# EAGLE design LM-317_power_supply (EAGLE 6.3)
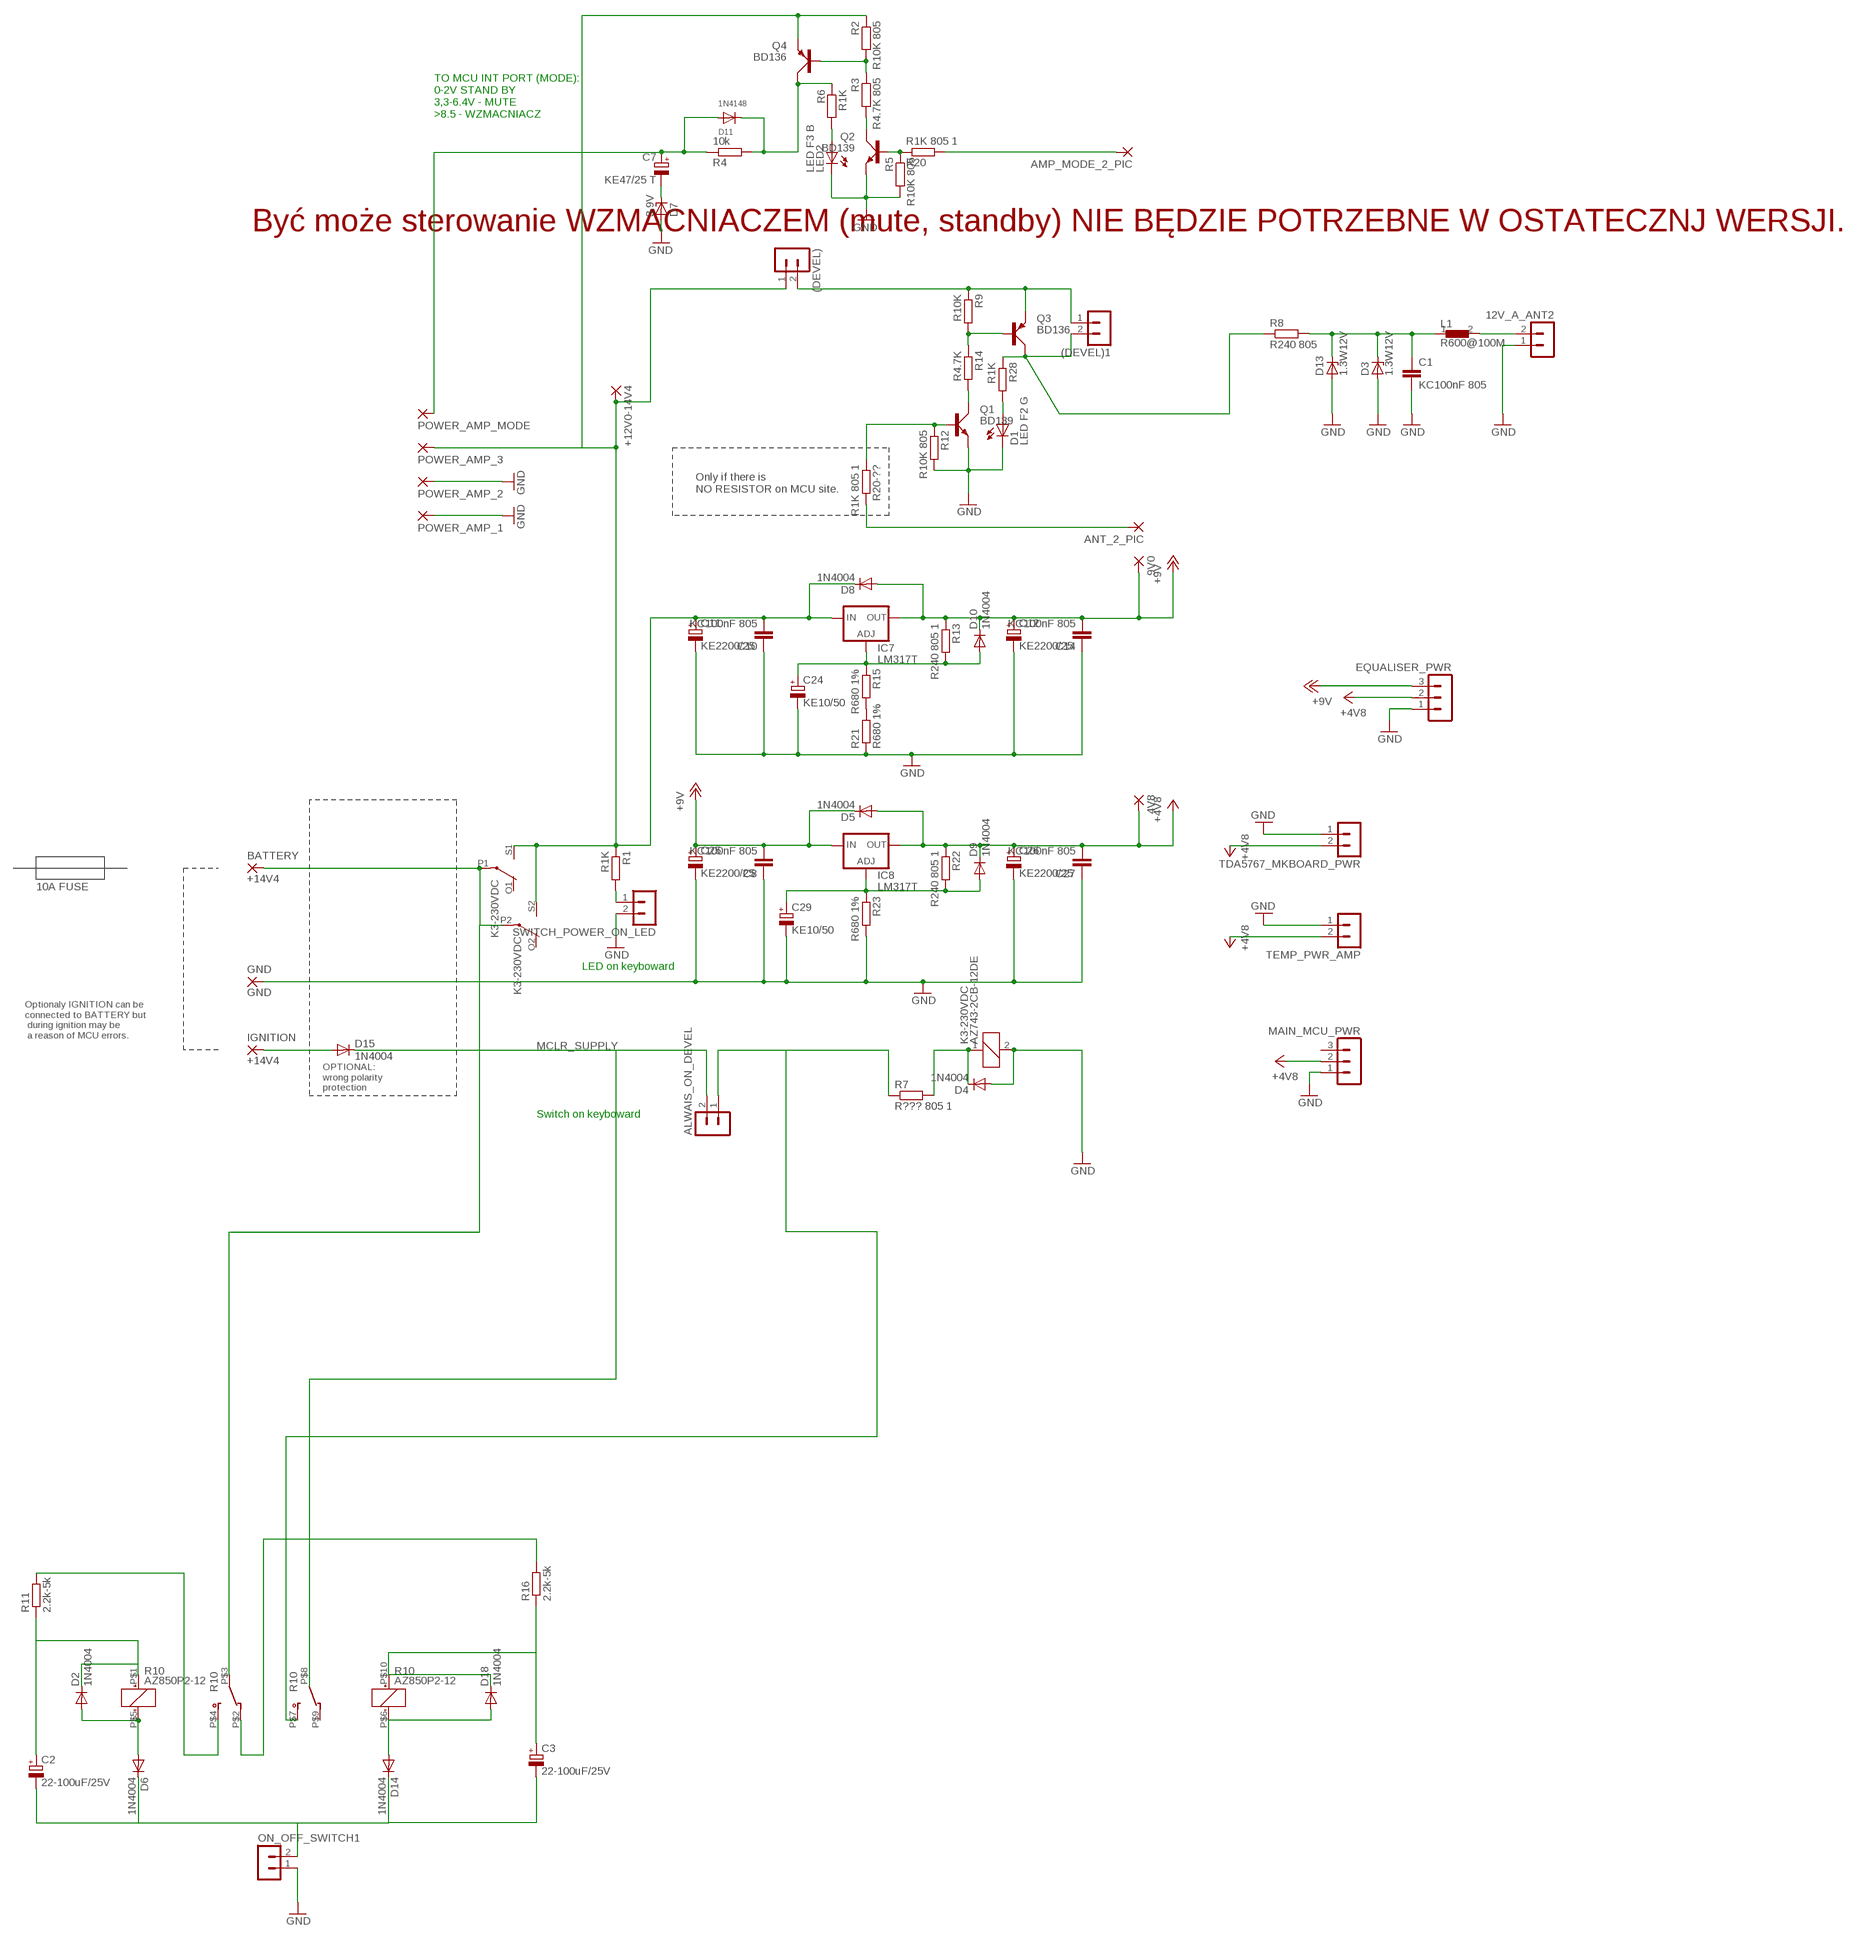
[diagram p0: schematic, sheet 1]

## Parts
4V8  3,17/1,3  [3,17/1,3]
9V0  3,17/1,3  [3,17/1,3]
12V_A_ANT2  MA02-1  [MA02-1]
(DEVEL)  MA02-1  [MA02-1]
(DEVEL)1  MA02-1  [MA02-1]
+12V0-14V4  3,17/1,3  [3,17/1,3]
ALWAIS_ON_DEVEL  MA02-1  [MA02-1]
AMP_MODE_2_PIC  1,6/0,8  [1,6/0,8]
ANT_2_PIC  1,6/0,8  [1,6/0,8]
BATTERY  +14V4  3,81/1,3  [3,81/1,3]
C1  KC100nF 805  C-EUC0805  [C0805]
C2  22-100uF/25V  CPOL-EUE2,5-6E  [E2,5-6E]
C3  22-100uF/25V  CPOL-EUE2,5-6E  [E2,5-6E]
C7  KE47/25 T  CPOL-EUB45181A  [B45181A]
C8  KC100nF 805  C-EUC0805  [C0805]
C10  KC100nF 805  C-EUC0805  [C0805]
C11  KE2200/25  CPOL-EUE3.5-8  [E3,5-8]
C12  KE2200/25  CPOL-EUE3.5-8  [E3,5-8]
C14  KC100nF 805  C-EUC0805  [C0805]
C24  KE10/50  CPOL-EUTT2D4  [TT2D4]
C25  KE2200/25  CPOL-EUE3.5-8  [E3,5-8]
C26  KE2200/25  CPOL-EUE3.5-8  [E3,5-8]
C27  KC100nF 805  C-EUC0805  [C0805]
C29  KE10/50  CPOL-EUTT2D4  [TT2D4]
D1  LED F2 G  SFH482  [SFH482]
D2  1N4004  1N4004DO41-7.6  [DO41-7.6]
D3  1.3W12V  ZENER-DIODEZD-2.5  [ZDIO-2.5]
D4  1N4004  1N4004DO41-7.6  [DO41-7.6]
D5  1N4004  1N4004DO41-7.6  [DO41-7.6]
D6  1N4004  1N4004DO41-7.6  [DO41-7.6]
D7  3.9V  ZENER-DIODEZD-5  [ZDIO-5]
D8  1N4004  1N4004DO41-7.6  [DO41-7.6]
D9  1N4004  1N4004DO41-7.6  [DO41-7.6]
D10  1N4004  1N4004DO41-7.6  [DO41-7.6]
D11  1N4148  DIODEDO-1N4148  [DO-1N4148]
D13  1.3W12V  ZENER-DIODEZD-2.5  [ZDIO-2.5]
D14  1N4004  1N4004DO41-7.6  [DO41-7.6]
D15  1N4004  1N4004DO41-7.6  [DO41-7.6]
D18  1N4004  1N4004DO41-7.6  [DO41-7.6]
EQUALISER_PWR  MA03-1  [MA03-1]
GND  GND  3,81/1,3  [3,81/1,3]
IC7  LM317T  LM317TS  [317TS]
IC8  LM317T  LM317TS  [317TS]
IGNITION  +14V4  3,81/1,3  [3,81/1,3]
K3-230VDC  AZ743-2CB-12DE  G2R2  [G2R2]
L1  R600@100M  FERRITR0805  [R0805]
LED2  LED F3 B  LED3MM  [LED3MM]
MAIN_MCU_PWR  MA03-1  [MA03-1]
ON_OFF_SWITCH1  MA02-1  [MA02-1]
POWER_AMP_1  3,17/1,3  [3,17/1,3]
POWER_AMP_2  3,17/1,3  [3,17/1,3]
POWER_AMP_3  3,17/1,3  [3,17/1,3]
POWER_AMP_MODE  3,17/1,3  [3,17/1,3]
Q1  BD139  [TO126AV]
Q2  BD139  [TO126AV]
Q3  BD136  BD140  [TO126AV]
Q4  BD136  BD140  [TO126AV]
R1  R1K  R-EU_0204/7  [0204/7]
R2  R10K 805  R-EU_R0805  [R0805]
R3  R4.7K 805  R-EU_R0805  [R0805]
R4  10k  R-EU_0204/5  [0204/5]
R5  R10K 805  R-EU_R0805  [R0805]
R6  R1K  R-EU_0204/2V  [0204V]
R7  R??? 805 1  R-EU_M0805  [M0805]
R8  R240 805  R-EU_M0805  [M0805]
R9  R10K  R-EU_0204/5  [0204/5]
R10  AZ850P2-12  [AZ850-2C]
R11  2.2k-5k  R-EU_0204/5  [0204/5]
R12  R10K 805  R-EU_R0805  [R0805]
R13  R240 805 1  R-EU_M0805  [M0805]
R14  R4.7K  R-EU_0204/5  [0204/5]
R15  R680 1%  R-EU_0204/5  [0204/5]
R16  2.2k-5k  R-EU_0204/5  [0204/5]
R20  R1K 805 1  R-EU_R0805  [R0805]
R20-??  R1K 805 1  R-EU_0204/2V  [0204V]
R21  R680 1%  R-EU_0204/5  [0204/5]
R22  R240 805 1  R-EU_M0805  [M0805]
R23  R680 1%  R-EU_0204/5  [0204/5]
R28  R1K  R-EU_0204/7  [0204/7]
SWITCH_POWER_ON_LED  MA02-1  [MA02-1]
TDA5767_MKBOARD_PWR  MA02-1  [MA02-1]
TEMP_PWR_AMP  MA02-1  [MA02-1]

## Nets
+4V8: 4V8.1(P) C26.+ C27.2 D5.A D9.C EQUALISER_PWR.2 IC8.2(OUT) MAIN_MCU_PWR.2 R22.1 TDA5767_MKBOARD_PWR.2 TEMP_PWR_AMP.2
+9V: 9V0.1(P) C8.2 C12.+ C14.2 C25.+ D5.C D8.A D10.C EQUALISER_PWR.3 IC7.2(OUT) IC8.3(IN) R13.1
+14.4V: (DEVEL).1 +12V0-14V4.1(P) C10.2 C11.+ D8.C IC7.3(IN) K3-230VDC.S1(2:S) K3-230VDC.S2(3:S) POWER_AMP_3.1(P) Q4.E R1.1 R2.1
AMP_MODE: AMP_MODE_2_PIC.1(P) R20.2
GND: 12V_A_ANT2.1 C1.2 C8.1 C10.1 C11.- C12.- C14.1 C24.- C25.- C26.- C27.1 C29.- D1.K(C) D3.A D4.A D7.A D13.A EQUALISER_PWR.1 GND.1(P) K3-230VDC.2 LED2.K(C) MAIN_MCU_PWR.1 ON_OFF_SWITCH1.1 POWER_AMP_1.1(P) POWER_AMP_2.1(P) Q1.E Q2.E R5.2 R12.2 R21.1 R23.2 SWITCH_POWER_ON_LED.2 TDA5767_MKBOARD_PWR.1 TEMP_PWR_AMP.1
MCLR_SUPPLY: ALWAIS_ON_DEVEL.2 D15.C
N$1: ANT_2_PIC.1(P) R20-??.2
N$2: C24.+ D10.A IC7.1(ADJ) R13.2 R15.1
N$3: R15.2 R21.2
N$4: (DEVEL)1.1 (DEVEL).2 Q3.E R9.1
N$6: BATTERY.1(P) K3-230VDC.P1(2:P) K3-230VDC.P2(3:P) R10.P$3
N$7: D4.C K3-230VDC.1 R7.2
N$8: ALWAIS_ON_DEVEL.1 R7.1 R10.P$7
N$9: R1.2 SWITCH_POWER_ON_LED.1
N$10: D11.C Q4.C R4.2 R6.1
N$11: C1.1 D3.C D13.C L1.1 R8.2
N$12: 12V_A_ANT2.2 L1.2
N$13: D15.A IGNITION.1(P)
N$14: C2.+ D2.C R10.P$1(S$1:+) R11.1
N$15: D2.A D6.A R10.P$5(S$1:-)
N$16: C3.+ D18.C R10.P$10(R$2:+) R16.1
N$18: Q1.B R12.1 R20-??.1
N$19: Q1.C R14.2
N$20: C2.- C3.- D6.C D14.C ON_OFF_SWITCH1.2
N$21: C7.- D7.C
N$23: C7.+ D11.A POWER_AMP_MODE.1(P) R4.1
N$24: D14.A D18.A R10.P$6(R$2:-)
N$25: Q3.B R9.2 R14.1
N$26: (DEVEL)1.2 Q3.C R8.1 R28.1
N$27: C29.+ D9.A IC8.1(ADJ) R22.2 R23.1
N$30: R10.P$4 R11.2
N$31: R10.P$2 R16.2
N$40: D1.A R28.2
N$47: Q2.B R5.1 R20.1
N$48: Q2.C R3.2
N$49: Q4.B R2.2 R3.1
N$52: LED2.A R6.2
Unconnected: K3-230VDC.O1(2:O) K3-230VDC.O2(3:O) MAIN_MCU_PWR.3 R10.P$8 R10.P$9

## Notes on the sheet
- TO MCU INT PORT (MODE): 
  0-2V STAND BY
  3,3-6.4V - MUTE
  >8.5 - WZMACNIACZ
- Być może sterowanie WZMACNIACZEM (mute, standby) NIE BĘDZIE POTRZEBNE W OSTATECZNJ WERSJI.
- Only if there is
  NO RESISTOR on MCU site.
- 10A FUSE
- LED on keyboward
- Optionaly IGNITION can be
  connected to BATTERY but
   during ignition may be
   a reason of MCU errors.
- OPTIONAL:
  wrong polarity
  protection
- Switch on keyboward

## Library data of the parts
4V8 9V0 +12V0-14V4 POWER_AMP_1-POWER_AMP_3 POWER_AMP_MODE = wirepad:3,17/1,3: THROUGH-HOLE PAD
12V_A_ANT2 (DEVEL) (DEVEL)1 ALWAIS_ON_DEVEL ON_OFF_SWITCH1 SWITCH_POWER_ON_LED TDA5767_MKBOARD_PWR TEMP_PWR_AMP = con-lstb_SileliS:MA02-1: PIN HEADER
AMP_MODE_2_PIC ANT_2_PIC = wirepad:1,6/0,8: THROUGH-HOLE PAD
BATTERY GND IGNITION = wirepad:3,81/1,3: THROUGH-HOLE PAD
C1 C8 C10 C14 C27 = rcl:C-EU: CAPACITOR, European symbol
C2 C3 = resistor:CPOL-EU: POLARIZED CAPACITOR, European symbol
C7 C11 C12 C24-C26 C29 = rcl:CPOL-EU: POLARIZED CAPACITOR, European symbol
D1 = led:SFH482: IR LED infrared emitting diode, Infineon
D2 D4-D6 D8-D10 D14 D15 D18 = diode_SileliS:1N4004: DIODE general purpose rectifier, 1 A
D3 D7 D13 = diode:ZENER-DIODE: Z-Diode
D11 = adafruit:DIODE: Diode SMADIODE - SMA Surface Mount Package 20V 1A Schottky Diode Digikey: 641-1014-6-ND DO-1N4148 - Through Hole Small Current Diode SOD-123 20V 1 A (.5mV Vf) Schottky Diode - Digikey: MBRX120TPMSCT-ND SOD-323 10V 570mA (.38mV Vf, 3ns) Schottky Diode - Digikey: ZLLS410CT-ND SOD-523 30V 30mA Schottky Diode (RB751S-40TE61) - Digikey: RB751S-40TE61CT-ND SOT23-R/W - SOT23 Package (R = Solder Paste/Reflow Ovens, W = Hand-Soldering) BAT54Film 40V 300mA - Digikey: 497-7162-1-ND
EQUALISER_PWR MAIN_MCU_PWR = con-lstb_SileliS:MA03-1: PIN HEADER; OC_FARNELL: unknown; OC_NEWARK: unknown
IC7 IC8 = v-reg:LM317TS: VOLTAGE REGULATOR
K3-230VDC = relay:G2R2: RELAY 2 x switch, Omron; MF: OMRON COMPONENTS USA; MPN: G2R-2-DC6; OC_FARNELL: unknown; OC_NEWARK: 89C5317
L1 = ferrit_bear:FERRIT
LED2 = led:LED: LED OSRAM: - CHIPLED LG R971, LG N971, LY N971, LG Q971, LY Q971, LO R971, LY R971 LH N974, LH R974 LS Q976, LO Q976, LY Q976 LO Q996 - Hyper CHIPLED LW Q18S LB Q993, LB Q99A, LB R99A - SideLED LS A670, LO A670, LY A670, LG A670, LP A670 LB A673, LV A673, LT A673, LW A673 LH A674 LY A675 LS A676, LA A676, LO A676, LY A676, LW A676 LS A679, LY A679, LG A679 - Hyper Micro SIDELED® LS Y876, LA Y876, LO Y876, LY Y876 LT Y87S - SmartLED LW L88C, LW L88S LB L89C, LB L89S, LG L890 LS L89K, LO L89K, LY L89K LS L896, LA L896, LO L896, LY L896 - TOPLED LS T670, LO T670, LY T670, LG T670, LP T670 LSG T670, LSP T670, LSY T670, LOP T670, LYG T670 LG T671, LOG T671, LSG T671 LB T673, LV T673, LT T673, LW T673 LH T674 LS T676, LA T676, LO T676, LY T676, LB T676, LH T676, LSB T676, LW T676 LB T67C, LV T67C, LT T67C, LS T67K, LO T67K, LY T67K, LW E67C LS E67B, LA E67B, LO E67B, LY E67B, LB E67C, LV E67C, LT E67C LW T67C LS T679, LY T679, LG T679 LS T770, LO T770, LY T770, LG T770, LP T770 LB T773, LV T773, LT T773, LW T773 LH T774 LS E675, LA E675, LY E675, LS T675 LS T776, LA T776, LO T776, LY T776, LB T776 LHGB T686 LT T68C, LB T68C - Hyper Mini TOPLED® LB M676 - Mini TOPLED Santana® LG M470 LS M47K, LO M47K, LY M47K Source: http://www.osram.convergy.de LUXEON: - LUMILED® LXK2-PW12-R00, LXK2-PW12-S00, LXK2-PW14-U00, LXK2-PW14-V00 LXK2-PM12-R00, LXK2-PM12-S00, LXK2-PM14-U00 LXK2-PE12-Q00, LXK2-PE12-R00, LXK2-PE12-S00, LXK2-PE14-T00, LXK2-PE14-U00 LXK2-PB12-K00, LXK2-PB12-L00, LXK2-PB12-M00, LXK2-PB14-N00, LXK2-PB14-P00, LXK2-PB14-Q00 LXK2-PR12-L00, LXK2-PR12-M00, LXK2-PR14-Q00, LXK2-PR14-R00 LXK2-PD12-Q00, LXK2-PD12-R00, LXK2-PD12-S00 LXK2-PH12-R00, LXK2-PH12-S00 LXK2-PL12-P00, LXK2-PL12-Q00, LXK2-PL12-R00 Source: www.luxeon.com KINGBRIGHT: KA-3528ASYC Source: www.kingbright.com
Q1 Q2 = transistor-power:BD139: NPN TRANSISTOR
Q3 Q4 = transistor-power:BD140: PNP TRANSISTOR
R1-R9 R12-R15 R20 R20-?? R21-R23 R28 = rcl:R-EU_: RESISTOR, European symbol
R10 = relay_silelis:AZ850P2-12
R11 R16 = resistor:R-EU_: RESISTOR, European symbol

## Board
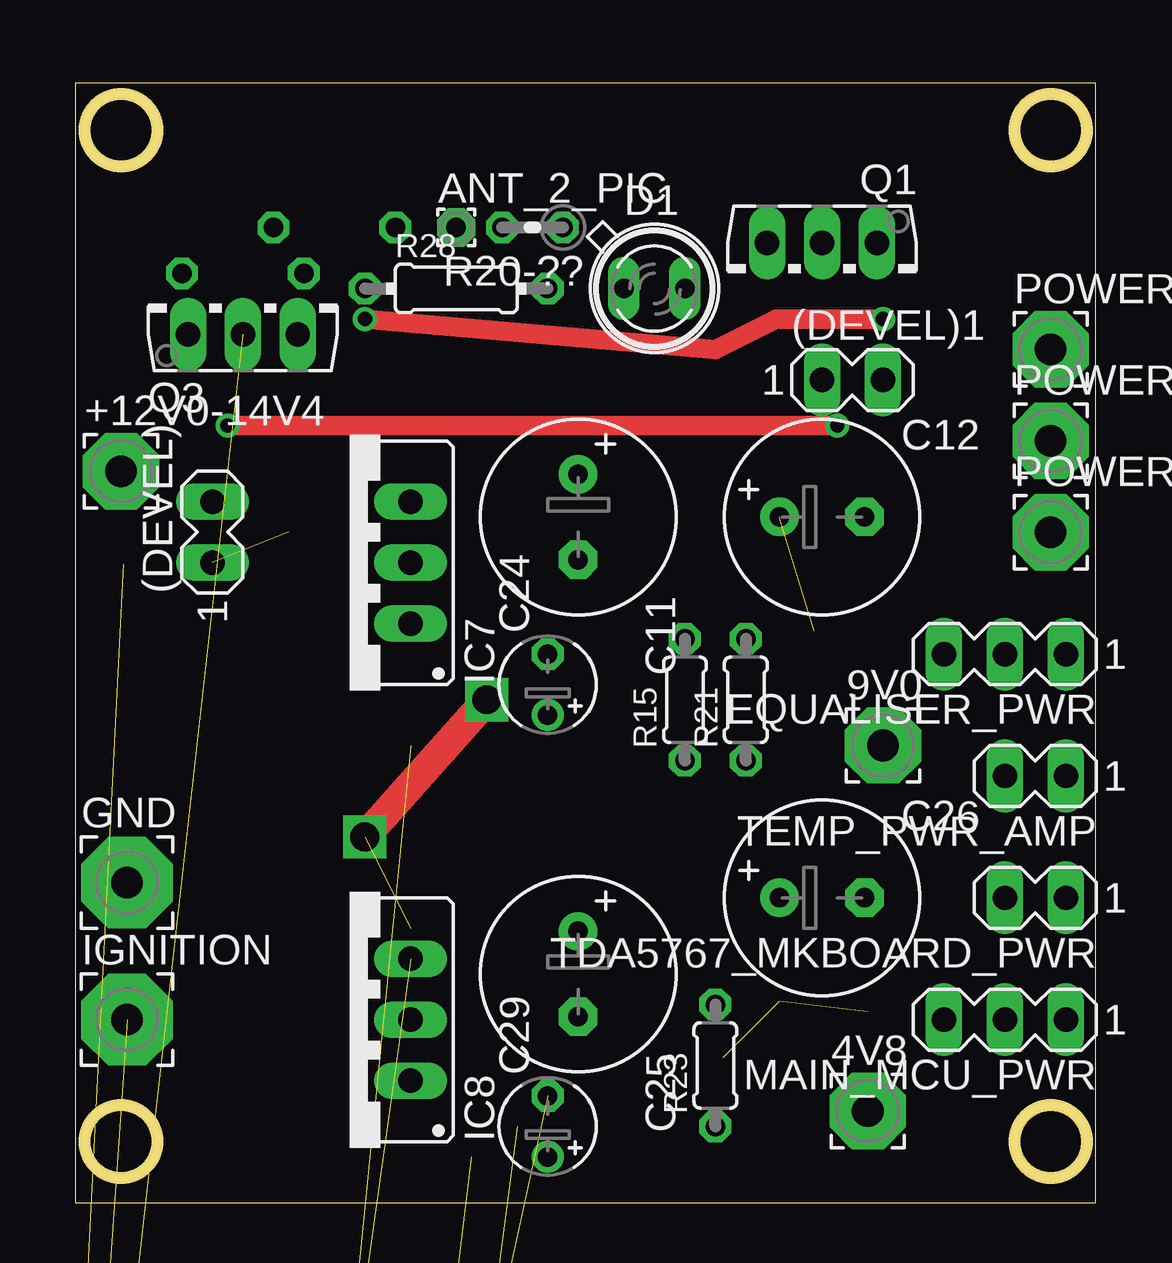
[diagram p1: board, top side]
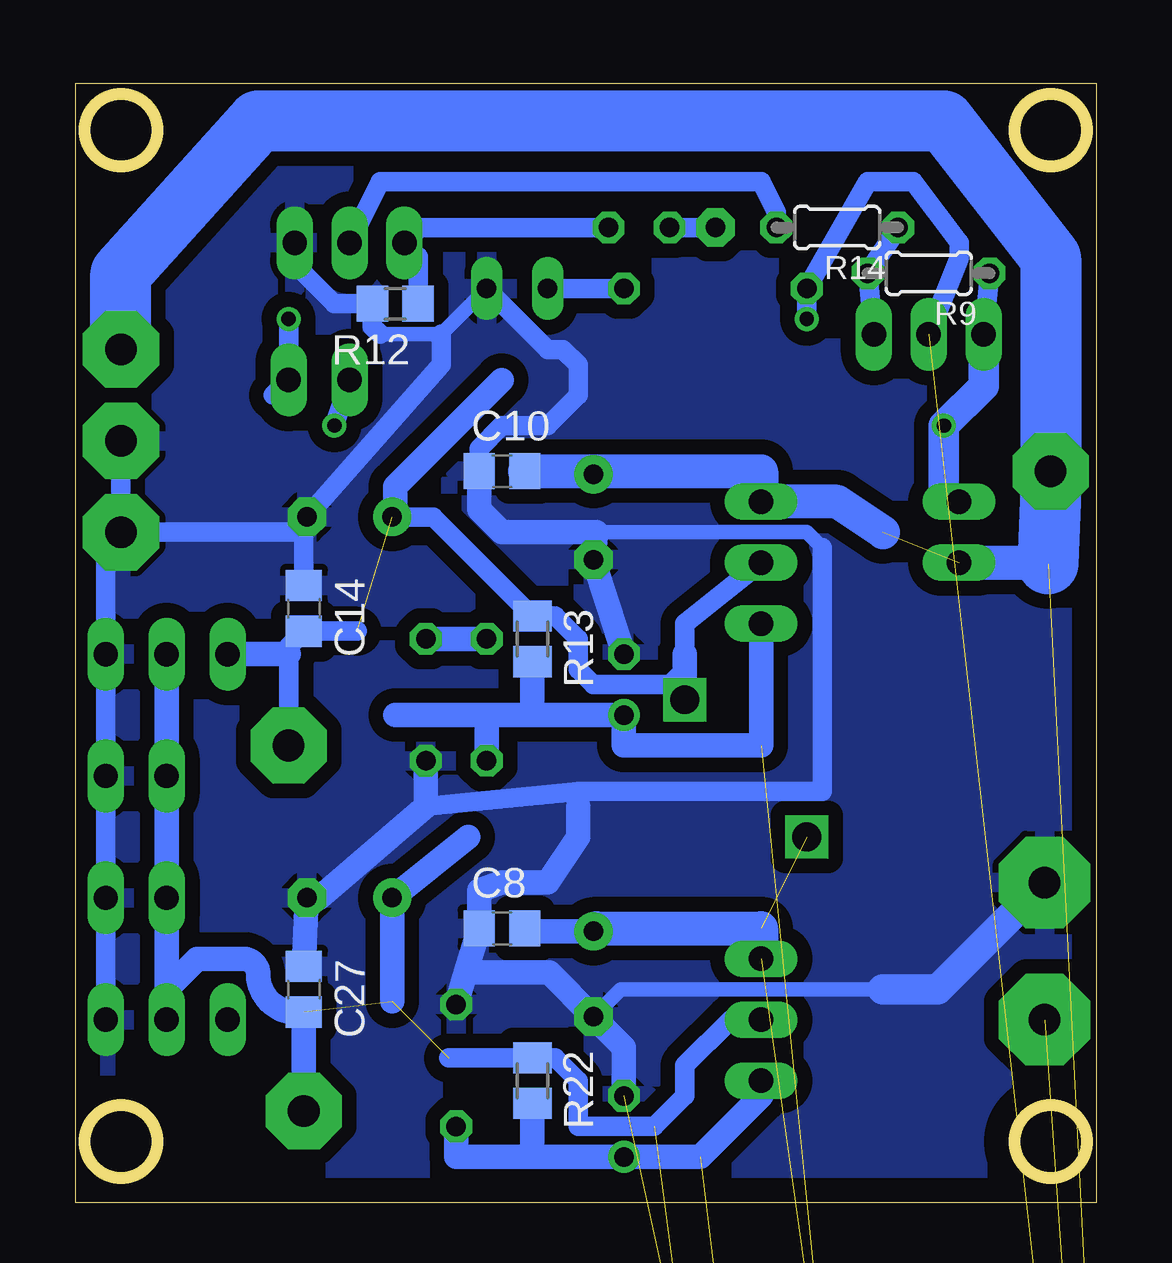
[diagram p2: board, bottom side, seen from below]

Size 42.52 x 46.66 mm. Coordinates in mm from the lower left corner, seen from the top.
Outline: 0,0 42.52,0 42.52,46.66 0,46.66 0,0
Outline: circle at 1.9,44.7 radius 1.5
Outline: circle at 40.64,2.54 radius 1.5
Outline: circle at 40.64,44.7 radius 1.5
Outline: circle at 1.9,2.54 radius 1.5
Copper layers (1*16): Top 0.035mm / dielectric 1.5mm / Bottom 0.035mm
Design rules "default": minimum track width 10mil, minimum drill 24mil, track to track 8mil, track to pad 8mil, pad to pad 8mil, via to via 8mil, smd to smd 8mil, copper to edge 40mil, drill to drill 8mil, minimum pad ring 10mil, minimum via ring 8mil, stop-mask expansion 4mil, vias tented up to drill 0mil, thermal gap 10mil

### Footprints (pad centres in the part's own frame; a part is rotated, then mirrored left to right if it is on the bottom)
3,17/1,3 = drill 1.321 pad 3.175 octagon: 1 0,0
MA02-1 = drill 1.016 long: 1 -2.54,0; 2 0,0
1,6/0,8 = drill 0.813 pad 1.6 octagon: 1 0,0
3,81/1,3 = drill 1.321 pad 3.81 octagon: 1 0,0
C0805 = smd 1.3 x 1.5: 1 -0.95,0; 2 0.95,0
E2,5-6E = drill 0.813 pad 1.575: + -1.27,0 | drill 0.813 pad 1.575 octagon: - 1.27,0
B45181A = drill 0.813 pad 1.6: + -1.27,0 | drill 0.813 pad 1.6 octagon: - 1.27,0
E3,5-8 = drill 0.813 pad 1.6: + -1.778,0 | drill 0.813 pad 1.6 octagon: - 1.778,0
TT2D4 = drill 0.813: + -1.27,0 | drill 0.813 octagon: - 1.27,0
SFH482 = drill 0.813 long: A -1.27,0; K 1.27,0
DO41-7.6 = drill 1.1 pad 1.7: A 3.81,0; C -3.81,0
ZDIO-2.5 = drill 0.813 octagon: A 1.27,0; C -1.27,0
ZDIO-5 = drill 0.813 octagon: A 2.54,0; C -2.54,0
DO-1N4148 = drill 0.9: A -3.81,0; C 3.81,0
MA03-1 = drill 1.016 long: 1 -2.54,0; 2 0,0; 3 2.54,0
317TS = drill 1.016 long: 1 -2.54,-2.54; 2 0,-2.54; 3 2.54,-2.54
G2R2 = drill 1.321 long: 1 -2.54,-3.683; 2 -2.54,3.81; O1 12.471,3.81; O2 12.471,-3.683; P1 17.45,3.81; P2 17.45,-3.683; S1 22.454,3.81; S2 22.454,-3.683
R0805 = smd 1.3 x 1.5: 1 -0.95,0; 2 0.95,0
LED3MM = drill 0.813 octagon: A -1.27,0; K 1.27,0
TO126AV = drill 1.016 long: B 2.286,-1.27; C 0,-1.27; E -2.286,-1.27
0204/7 = drill 0.813 octagon: 1 -3.81,0; 2 3.81,0
0204/5 = drill 0.813 octagon: 1 -2.54,0; 2 2.54,0
0204V = drill 0.813 octagon: 1 -1.27,0; 2 1.27,0
M0805 = smd 1.3 x 1.6: 1 -0.95,0; 2 0.95,0
AZ850-2C = drill 0.6 octagon: P$1 -5.08,3.81; P$2 -2.54,3.81; P$3 0,3.81; P$4 2.54,3.81; P$5 5.08,3.81; P$6 5.08,-3.81; P$7 2.54,-3.81; P$8 0,-3.81; P$9 -2.54,-3.81; P$10 -5.08,-3.81

### Placement (x,y rotation side)
4V8  33.02,3.81 0 top
9V0  33.66,19.05 0 top
12V_A_ANT2  -19.69,-143.51 0 top  (outside the outline)
(DEVEL)  5.71,29.21 90 top
(DEVEL)1  33.66,34.29 0 top
+12V0-14V4  1.9,30.48 0 top
ALWAIS_ON_DEVEL  -19.69,-7.62 0 top  (outside the outline)
AMP_MODE_2_PIC  -10.8,-69.85 0 top  (outside the outline)
ANT_2_PIC  15.88,40.64 0 top
BATTERY  -16.89,19.05 0 top  (outside the outline)
C1  -22.23,-124.46 0 top  (outside the outline)
C2  -22.23,-175.26 0 top  (outside the outline)
C3  -22.23,-181.61 0 top  (outside the outline)
C7  -9.53,-39.37 0 top  (outside the outline)
C8  24.77,11.43 0 bottom
C10  24.77,30.48 0 bottom
C11  20.95,28.57 270 top
C12  31.11,28.57 0 top
C14  33.02,24.77 270 bottom
C24  19.68,21.59 90 top
C25  20.95,9.53 270 top
C26  31.11,12.7 0 top
C27  33.02,8.89 270 bottom
C29  19.68,3.18 90 top
D1  24.13,38.1 0 top
D2  -19.69,-219.71 0 top  (outside the outline)
D3  -22.23,-137.16 0 top  (outside the outline)
D4  -19.69,-288.29 0 top  (outside the outline)
D5  -19.69,-257.81 0 top  (outside the outline)
D6  -19.69,-227.33 0 top  (outside the outline)
D7  9.52,-30.48 0 top  (outside the outline)
D8  -19.69,-273.05 0 top  (outside the outline)
D9  -19.69,-265.43 0 top  (outside the outline)
D10  -19.69,-280.67 0 top  (outside the outline)
D11  5.71,-57.15 0 top  (outside the outline)
D13  -12.07,-137.16 0 top  (outside the outline)
D14  -19.69,-234.95 0 top  (outside the outline)
D15  -19.69,-250.19 0 top  (outside the outline)
D18  -19.69,-242.57 0 top  (outside the outline)
EQUALISER_PWR  38.73,22.86 180 top
GND  2.16,13.33 0 top
IC7  11.43,26.67 90 top
IC8  11.43,7.62 90 top
IGNITION  2.16,7.62 0 top
K3-230VDC  -19.69,-107.95 0 top  (outside the outline)
L1  -23.49,-130.81 0 top  (outside the outline)
LED2  -9.53,-58.42 0 top  (outside the outline)
MAIN_MCU_PWR  38.73,7.62 180 top
ON_OFF_SWITCH1  -19.69,-201.93 0 top  (outside the outline)
POWER_AMP_1  40.64,27.94 0 top
POWER_AMP_2  40.64,31.75 0 top
POWER_AMP_3  40.64,35.56 0 top
POWER_AMP_MODE  -9.53,-64.77 0 top  (outside the outline)
Q1  31.11,38.73 180 top
Q2  -6.98,-27.94 0 top  (outside the outline)
Q3  6.98,37.46 0 top
Q4  1.9,-27.94 0 top  (outside the outline)
R1  3.17,-25.4 0 top  (outside the outline)
R2  1.9,-45.72 0 top  (outside the outline)
R3  5.71,-38.1 0 top  (outside the outline)
R4  8.25,-52.07 0 top  (outside the outline)
R5  -9.53,-52.07 0 top  (outside the outline)
R6  1.9,-52.07 0 top  (outside the outline)
R7  -22.23,-87.63 0 top  (outside the outline)
R8  -10.8,-130.81 0 top  (outside the outline)
R9  6.98,38.73 180 bottom
R10  -17.15,-151.13 0 top  (outside the outline)
R11  -20.95,-207.01 0 top  (outside the outline)
R12  29.21,37.46 180 bottom
R13  23.49,23.49 270 bottom
R14  10.79,40.64 180 bottom
R15  25.4,20.95 90 top
R16  -20.95,-213.36 0 top  (outside the outline)
R20  -9.53,-45.72 0 top  (outside the outline)
R20-??  19.05,40.64 180 top
R21  27.94,20.95 90 top
R22  23.49,5.08 270 bottom
R23  26.67,5.71 90 top
R28  15.88,38.1 0 top
SWITCH_POWER_ON_LED  -5.71,-82.55 0 top  (outside the outline)
TDA5767_MKBOARD_PWR  38.73,12.7 180 top
TEMP_PWR_AMP  38.73,17.78 180 top

### Tracks (layer width: path | path; a pad name or v marks a point on that pad's centre or on a via)
+4V8  (4 unrouted)
  Bottom 0.813: IC8.2 15.24,7.62 17.14,5.71 17.14,4.45 18.41,3.18 21.59,3.18 21.59,5.08 22.54,6.03 R22.1 26.98,6.03
  Bottom 1.016: 4V8.1 C27.2 arc100 34.92,9.53 arc-90 35.56,10.16 37.47,10.16 38.73,8.89 MAIN_MCU_PWR.2 TDA5767_MKBOARD_PWR.2 TEMP_PWR_AMP.2 EQUALISER_PWR.2 | 29.34,8.38 C26.+ 26.16,15.24
+9V  (via drill 1.2)  (5 unrouted)
  Top 1.27: v12.06,15.24 v17.14,20.95
  Bottom 0.813: IC7.2 17.14,24.13 17.14,22.86 17.14,22.23 17.78,21.59 20.95,21.59 21.59,22.23 21.59,23.49 22.54,24.45 R13.1 27.62,28.57 C12.+ | 30.8,23.81 C14.2 33.66,23.18 33.66,22.86 9V0.1
  Bottom 1.016: 24.77,34.29 29.21,29.84 29.21,28.7 C12.+ | EQUALISER_PWR.3 33.66,22.86 | C25.+ 23.81,11.3 C8.2 | v17.14,20.95 17.14,22.86
  Bottom 1.422: IC8.3 13.97,11.43 20.83,11.43 C25.+
+14.4V  (7 unrouted)
  Bottom 1.422: 8.89,27.94 10.79,29.21 IC7.3 13.97,30.48 20.83,30.48 arc-90 C11.+ arc-90 21.08,30.48 C10.2 | 2.54,31.12 arc90 +12V0-14V4.1 | 2.54,29.84 arc90 1.9,29.21 | (DEVEL).1 2.01,26.67 2.01,26.62
  Bottom 2.54: 2.01,26.62 1.9,29.21 +12V0-14V4.1 1.9,39.37 6.35,45.09 34.92,45.09 40.64,38.73 POWER_AMP_3.1
AMP_MODE  (1 unrouted)
GND  (12 unrouted)
  Bottom 0.61: C25.- 19.81,8.89 8.89,8.89 | 11.43,27.3 12.06,27.94 21.08,27.94 | D1.K 27.3,36.2 29.84,36.2
  Bottom 0.813: C12.- 33.02,28.45 C14.1 | 21.08,27.94 C11.- | 11.43,27.3 11.43,17.15 21.59,17.15 | 21.59,17.15 21.59,16.51 | 27.94,16.51 21.59,17.15 | Q1.E 33.4,39.12 31.75,37.46 R12.2 30.16,36.51 29.84,36.2 | C12.- 33.53,27.94 POWER_AMP_1.1 | MAIN_MCU_PWR.1 TDA5767_MKBOARD_PWR.1 TEMP_PWR_AMP.1 EQUALISER_PWR.1 41.27,27.94 POWER_AMP_1.1 | POWER_AMP_1.1 POWER_AMP_2.1 | C12.- 27.3,34.92 27.3,36.2 | C10.1 25.71,31.43 24.77,32.38 22.86,32.38 21.59,33.66 21.59,34.92 22.22,35.56 22.86,35.56 D1.K
  Bottom 1.016: R23.2 26.27,9.6 | 26.27,9.6 C8.1 25.71,13.02 24.77,13.33 22.86,13.33 21.59,15.24 21.59,16.51 | C27.1 C26.- 32.38,12.7 27.94,16.51 R21.1 | 26.27,9.6 22.8,9.6 C25.- 19.68,6.48 C29.- | C24.- C11.- 20.83,27.94 21.08,27.94 24.77,27.94 25.71,28.89 C10.1
  Bottom 1.27: 8.89,8.89 6.6,8.89 GND.1
  Bottom 1.676: GND.1 2.54,13.97
  pour Bottom (isolate 0.61): -0.64,48.26 45.09,48.26 45.09,10.16 45.09,-2.54 -1.91,-2.54 -1.91,0 -1.91,46.99
MCLR_SUPPLY  (1 unrouted)
N$1
  Bottom 0.813: ANT_2_PIC.1 R20-??.2
N$2  (1 unrouted)
  Bottom 1.016: 23.49,20.32 C24.+ 19.68,19.05 13.97,19.05 IC7.1 | R13.2 23.49,20.32 | 29.21,20.32 25.4,20.32 | 25.4,20.32 23.49,20.32 | R15.1 25.4,20.32
N$3
  Bottom 1.016: R15.2 R21.2
N$4  (via drill 0.6)
  Top 0.813: v6.35,32.38 v31.75,32.38
  Bottom 0.813: R9.1 Q3.E | v31.75,32.38 (DEVEL)1.1
  Bottom 1.27: (DEVEL).2 6.35,29.21 v6.35,32.38 4.7,34.04 Q3.E
N$6  (3 unrouted)
N$7  (2 unrouted)
N$8  (2 unrouted)
N$9  (1 unrouted)
N$10  (3 unrouted)
N$11  (4 unrouted)
N$12  (1 unrouted)
N$13  (1 unrouted)
N$14  (3 unrouted)
N$15  (2 unrouted)
N$16  (3 unrouted)
N$18
  Bottom 0.813: R20-??.1 28.19,40.64 Q1.B 28.26,39.44 R12.1
N$19
  Bottom 0.813: R14.2 13.33,41.27 13.97,42.55 29.84,42.55 Q1.C
N$20  (4 unrouted)
N$21  (1 unrouted)
N$23  (3 unrouted)
N$24  (2 unrouted)
N$25
  Bottom 0.813: Q3.B R9.2 R14.1
N$26  (via drill 0.6)  (1 unrouted)
  Top 0.813: v12.06,36.83 26.67,35.56 29.21,36.83 v33.66,36.83
  Bottom 0.813: Q3.C 5.71,39.37 5.71,40 7.62,42.55 9.52,42.55 R28.1 v12.06,36.83 | 34.29,33.66 (DEVEL)1.2 v33.66,36.83
N$27  (1 unrouted)
  Bottom 1.016: IC8.1 13.97,4.45 16.51,1.91 C29.+ 23.49,1.91 | 23.49,1.91 26.67,1.91 R23.1 | R22.2 23.49,1.91
N$30  (1 unrouted)
N$31  (1 unrouted)
N$40
  Bottom 0.813: D1.A R28.2
N$47  (2 unrouted)
N$48  (1 unrouted)
N$49  (2 unrouted)
N$52  (1 unrouted)